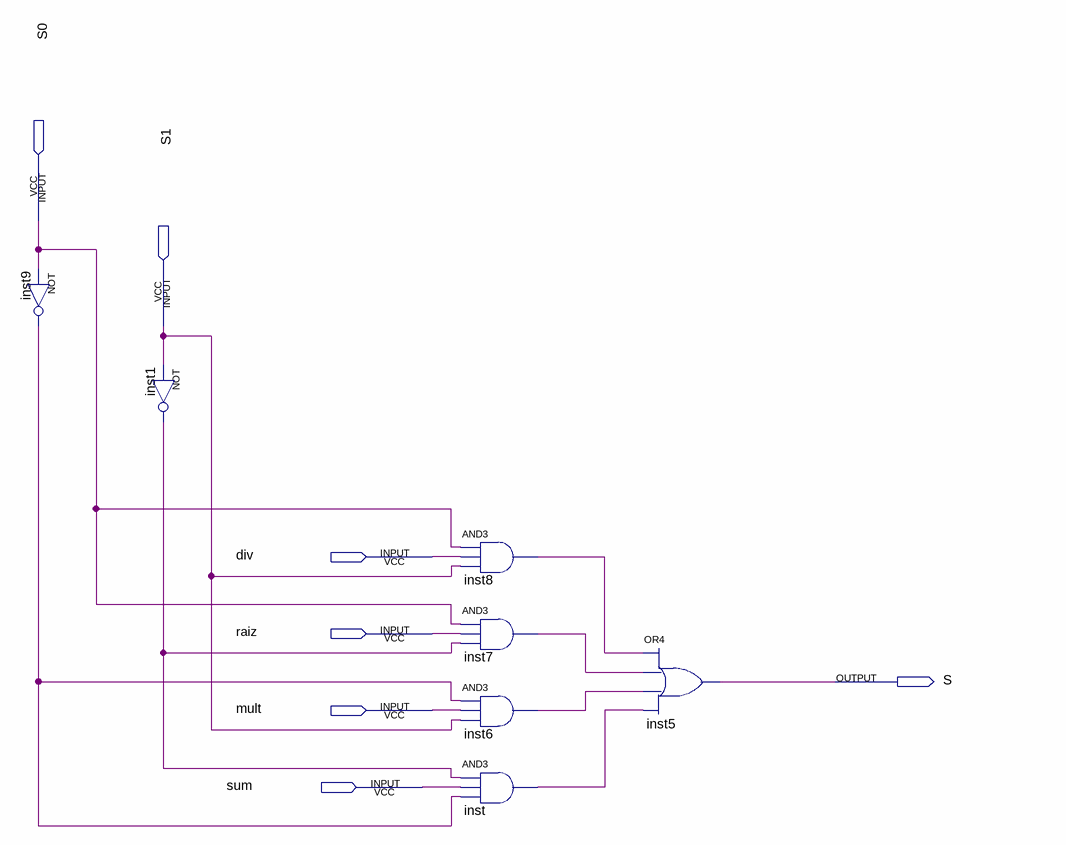
[diagram p0: schematic sheet]
// Quartus schematic mux_uni.bdf as structural Verilog: 7 symbols, 7 pins
module mux_uni (
  input  S0,
  input  S1,
  input  div,
  input  raiz,
  input  mult,
  input  sum,
  output S
);

  wire inst1_out, inst6_out, inst7_out, inst8_out, inst9_out, inst_out;

  not inst9 (inst9_out, S0);
  not inst1 (inst1_out, S1);
  and inst8 (inst8_out, S0, div, S1);
  and inst7 (inst7_out, S0, raiz, inst1_out);
  and inst6 (inst6_out, inst9_out, mult, S1);
  and inst (inst_out, inst1_out, sum, inst9_out);
  or inst5 (S, inst8_out, inst7_out, inst6_out, inst_out);
endmodule
